# EAGLE design SWDIsolator (EAGLE 7.7.0)
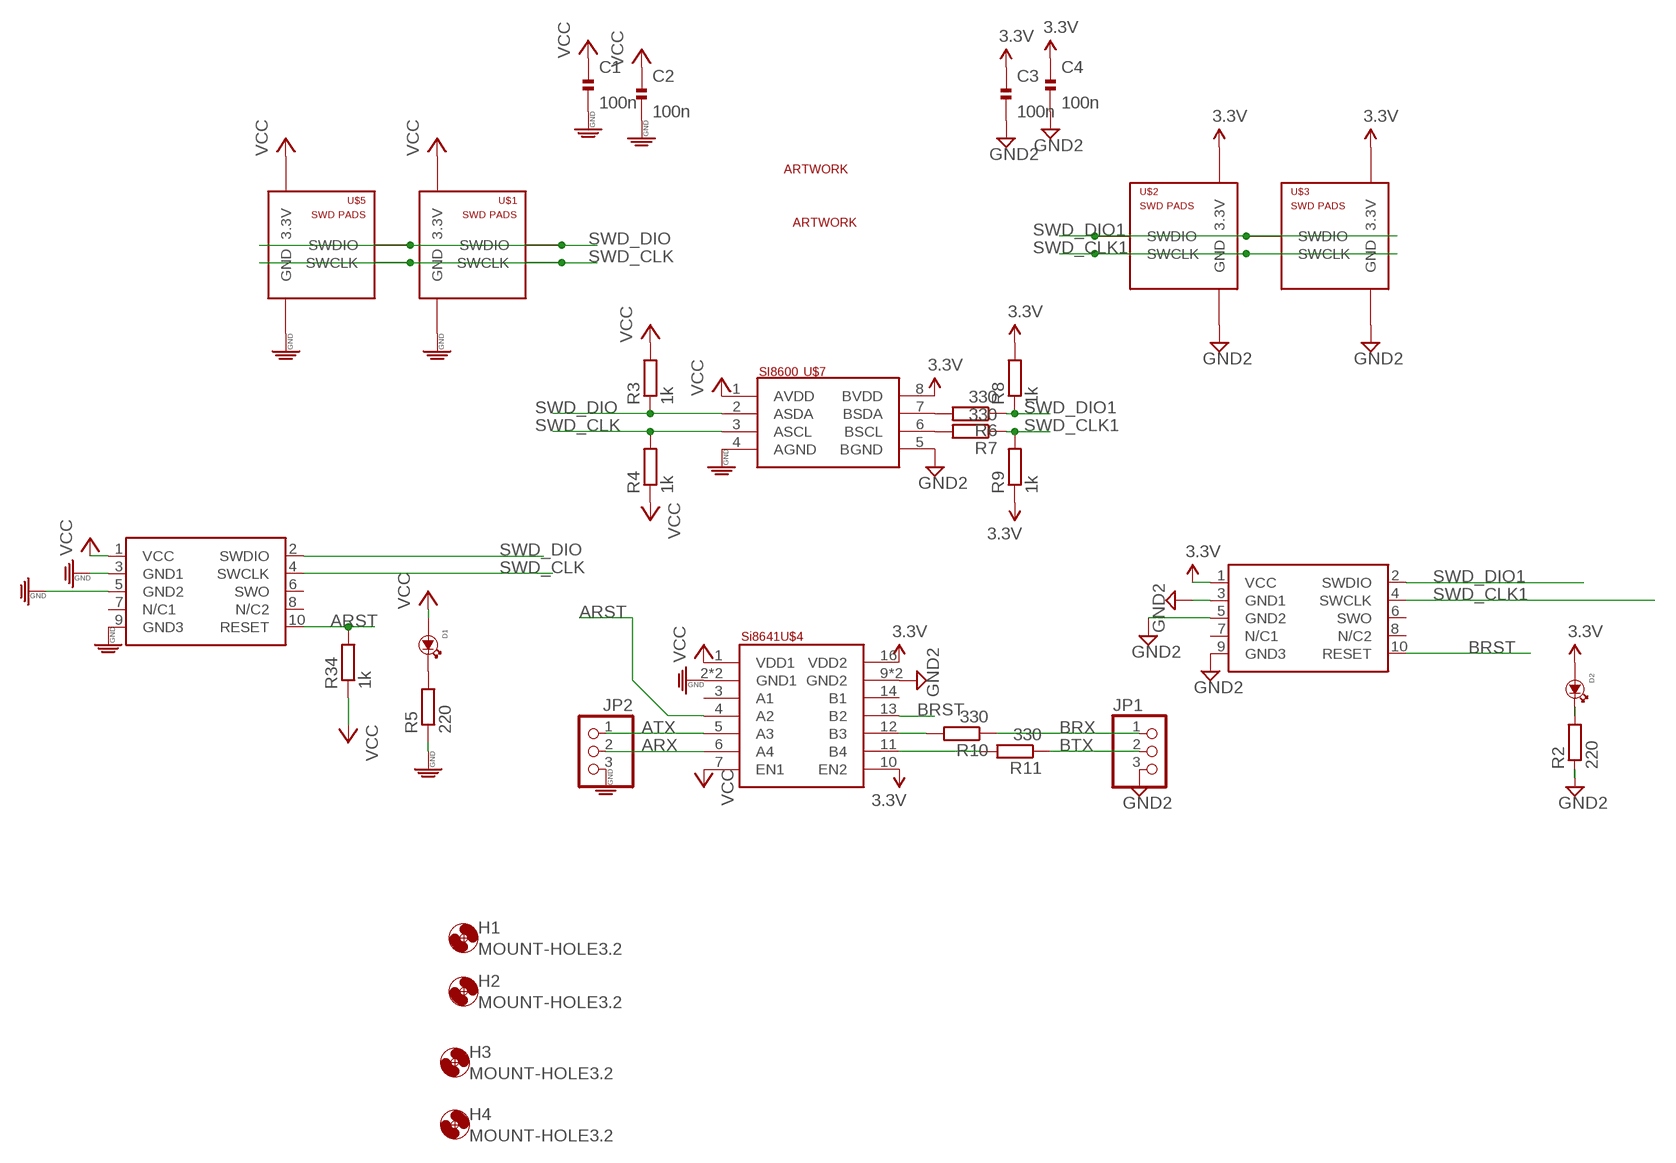
[diagram p0: schematic, sheet 1]

## Parts
C1  100n  C-EUC0402  [C0402]
C2  100n  C-EUC0402  [C0402]
C3  100n  C-EUC0402  [C0402]
C4  100n  C-EUC0402  [C0402]
D1  LED  [LED0603]
D2  LED  [LED0603]
H1  MOUNT-HOLE3.2  [3,2]
H2  MOUNT-HOLE3.2  [3,2]
H3  MOUNT-HOLE3.2  [3,2]
H4  MOUNT-HOLE3.2  [3,2]
JP1  PINHD-1X3CB  [1X03-CLEANBIG]
JP2  PINHD-1X3CB  [1X03-CLEANBIG]
R2  220  R-EU_R0402  [R0402]
R3  1k  R-EU_R0402  [R0402]
R4  1k  R-EU_R0402  [R0402]
R5  220  R-EU_R0402  [R0402]
R6  330  R-EU_R0402  [R0402]
R7  330  R-EU_R0402  [R0402]
R8  1k  R-EU_R0402  [R0402]
R9  1k  R-EU_R0402  [R0402]
R10  330  R-EU_R0402  [R0402]
R11  330  R-EU_R0402  [R0402]
R34  1k  R-EU_R0402  [R0402]
SWD1  CORTEX_SWD  [M50-3600542]
SWD2  CORTEX_SWD  [M50-3600542]
U$1  SWD_PADS  [SWDPADS]
U$2  SWD_PADS  [SWDPADS]
U$3  SWD_PADS_NOTITLE  [SWDPADS_NOTITLE]
U$4  SI8641  [SO16]
U$5  SWD_PADS_NOTITLE  [SWDPADS_NOTITLE]
U$6  TINRS_ARTWORKLOGO  [TINRSLOGO]
U$7  SI8600AB  SI8600  [SO8]
U$8  TINRS_ARTWORKROCKET  [TINRS_ROCKET]

## Nets
3.3V [power]: C3.1 C4.1 D2.+ R8.2 R9.1 SWD2.1(VCC) U$2.3.3V U$3.3.3V U$4.10(EN2) U$4.16(VDD2) U$7.8(BVDD)
ARST: R34.2 SWD1.10(RESET) U$4.4(A2)
ARX: JP2.2 U$4.6(A4)
ATX: JP2.1 U$4.5(A3)
BRST: SWD2.10(RESET) U$4.13(B2)
BRX: JP1.1 R10.1
BTX: JP1.2 R11.1
GND: C1.2 C2.2 JP2.3 R5.1 SWD1.3(GND1) SWD1.5(GND2) SWD1.9(GND3) U$1.GND U$4.2(GND1) U$4.8(GND1) U$5.GND U$7.4(AGND)
GND2: C3.2 C4.2 JP1.3 R2.1 SWD2.3(GND1) SWD2.5(GND2) SWD2.9(GND3) U$2.GND U$3.GND U$4.9(GND2) U$4.15(GND2) U$7.5(BGND)
N$1: R6.2 U$7.7(BSDA)
N$2: D1.- R5.2
N$3: D2.- R2.2
N$4: R7.2 U$7.6(BSCL)
N$5: R10.2 U$4.12(B3)
N$6: R11.2 U$4.11(B4)
SWD_CLK: R4.2 SWD1.4(SWCLK) U$1.SWCLK U$5.SWCLK U$7.3(ASCL)
SWD_CLK1: R7.1 R9.2 SWD2.4(SWCLK) U$2.SWCLK U$3.SWCLK
SWD_DIO: R3.1 SWD1.2(SWDIO) U$1.SWDIO U$5.SWDIO U$7.2(ASDA)
SWD_DIO1: R6.1 R8.1 SWD2.2(SWDIO) U$2.SWDIO U$3.SWDIO
VCC: C1.1 C2.1 D1.+ R3.2 R4.1 R34.1 SWD1.1(VCC) U$1.3.3V U$4.1(VDD1) U$4.7(EN1) U$5.3.3V U$7.1(AVDD)
Unconnected: SWD1.6(SWO) SWD1.7(N/C1) SWD1.8(N/C2) SWD2.6(SWO) SWD2.7(N/C1) SWD2.8(N/C2) U$4.3(A1) U$4.14(B1)

## Library data of the parts
C1-C4 = resistor:C-EU: CAPACITOR, European symbol
D1 D2 = EurorackModularParts:LED*: LED
H1-H4 = holes:MOUNT-HOLE: MOUNTING HOLE with drill center marker
JP1 JP2 = adafruit:PINHD-1X3: PIN HEADER
R2-R11 R34 = resistor:R-EU_: RESISTOR, European symbol; OC_FARNELL: unknown
SWD1 SWD2 = carrilib with jtags:CORTEX_SWD: .05" Cortex M Connector in SWD mode Manufacturer: Generic Part Number: Cortex M SWD Notes: I use Harwin M50-3600542 connectors; OC_FARNELL: unknown
U$1-U$3 U$5 = FenixBase:SWD_PADS
U$4 = FenixBase:SI8641
U$6 U$8 = EurorackModularParts:TINRS_ARTWORK
U$7 = FenixBase:SI8600

## Net classes
0 default: width 0.254 mm
1 power: width 0.305 mm

## Board
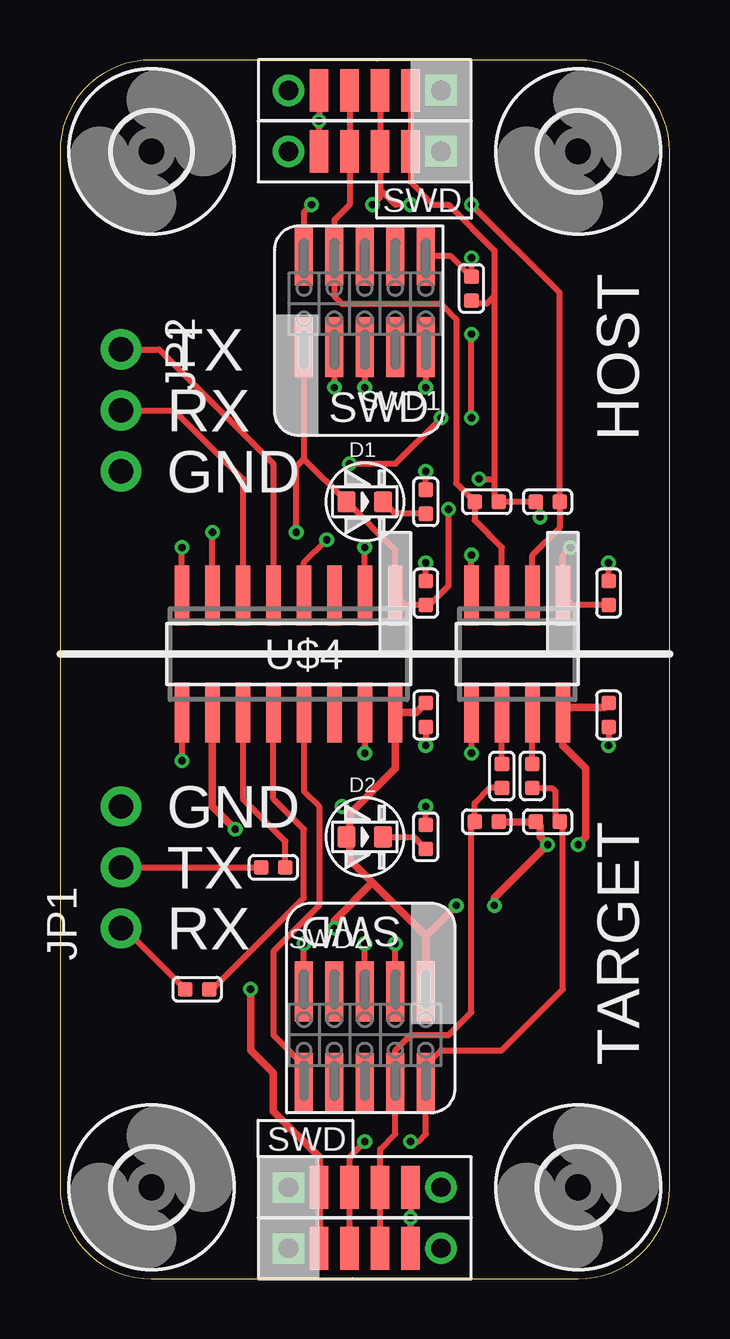
[diagram p1: board, top side]
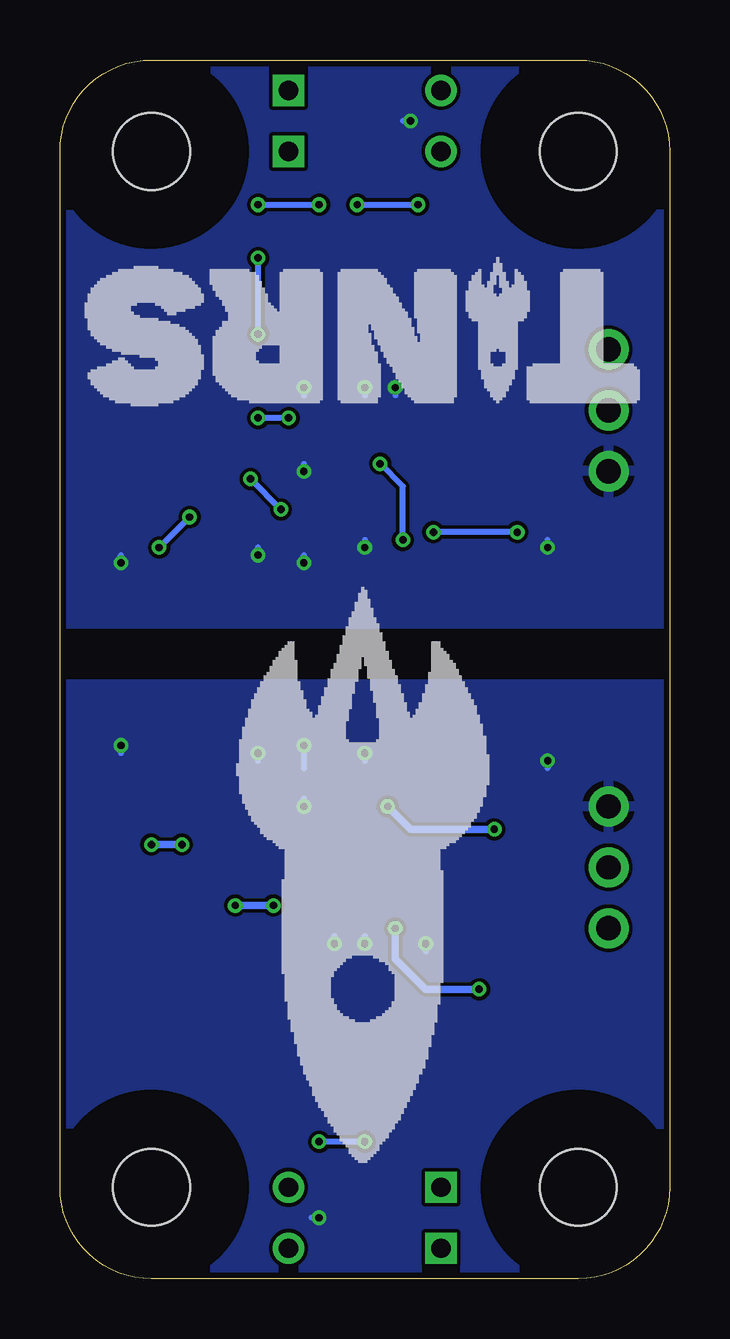
[diagram p2: board, bottom side, seen from below]

Size 25.4 x 50.8 mm. Coordinates in mm from the lower left corner, seen from the top.
Outline: 0,46.99 0,3.81 arc90 3.81,0 21.59,0 arc90 25.4,3.81 25.4,46.99 arc90 21.59,50.8 3.81,50.8 arc90 0,46.99
Copper layers (1*16): Top 0.035mm / dielectric 1.5mm / Bottom 0.035mm
Design rules "dirt_cheap_dirty_boards.v1.1": minimum track width 6mil, minimum drill 12mil, track to track 6mil, track to pad 6mil, pad to pad 6mil, via to via 6mil, smd to smd 0mil, copper to edge 10mil, drill to drill 10mil, minimum pad ring 10mil, minimum via ring 6mil, stop-mask expansion 2mil, vias tented up to drill 25mil, thermal gap 10mil

### Footprints (pad centres in the part's own frame; a part is rotated, then mirrored left to right if it is on the bottom)
C0402 = smd 0.6 x 0.6: 1 -0.5,0; 2 0.5,0
LED0603 = smd 0.762 x 0.889: + -0.762,0; - 0.762,0
3,2 = hole 3.2: 0,0
1X03-CLEANBIG = drill 1.016 pad 1.676: 1 -2.54,0; 2 0,0; 3 2.54,0
R0402 = smd 0.6 x 0.6: 1 -0.5,0; 2 0.5,0
M50-3600542 = smd 0.75 x 2.5: 1 -2.54,-1.81; 2 -2.54,2; 3 -1.27,-1.81; 4 -1.27,2; 5 0,-1.81; 6 0,2; 7 1.27,-1.81; 8 1.27,2; 9 2.54,-1.81; 10 2.54,2
SWDPADS = smd 0.762 x 1.778: 3.3V -1.905,0; GND 1.905,0; SWCLK 0.635,0; SWDIO -0.635,0 | drill 0.8 square: P$6 -3.175,0 | drill 0.8: P$7 3.175,0
SWDPADS_NOTITLE = smd 0.762 x 1.778: 3.3V -1.905,0; GND 1.905,0; SWCLK 0.635,0; SWDIO -0.635,0 | drill 0.8 square: P$6 -3.175,0 | drill 0.8: P$7 3.175,0
SO16 = smd 0.6 x 2.5: 1 -4.445,-2.435; 2 -3.175,-2.435; 3 -1.905,-2.435; 4 -0.635,-2.435; 5 0.635,-2.435; 6 1.905,-2.435; 7 3.175,-2.435; 8 4.445,-2.435; 9 4.445,2.435; 10 3.175,2.435; 11 1.905,2.435; 12 0.635,2.435; 13 -0.635,2.435; 14 -1.905,2.435; 15 -3.175,2.435; 16 -4.445,2.435
SO8 = smd 0.6 x 2.5: 1 -1.905,-2.435; 2 -0.635,-2.435; 3 0.635,-2.435; 4 1.905,-2.435; 5 1.905,2.435; 6 0.635,2.435; 7 -0.635,2.435; 8 -1.905,2.435

### Placement (x,y rotation side)
C1  15.24,28.57 90 top
C2  22.86,28.57 90 top
C3  22.86,23.5 270 top
C4  15.24,23.5 270 top
D1  12.7,32.38 0 top
D2  12.7,18.41 0 top
H1  3.81,3.81 0 top
H2  21.59,3.81 0 top
H3  3.81,46.99 0 top
H4  21.59,46.99 0 top
JP1  2.54,17.14 90 top
JP2  2.54,36.2 270 top
R2  15.24,18.41 270 top
R3  20.32,32.38 180 top
R4  17.78,32.38 180 top
R5  15.24,32.38 270 top
R6  19.68,20.95 90 top
R7  18.41,20.95 90 top
R8  20.32,19.05 180 top
R9  17.78,19.05 180 top
R10  5.71,12.06 0 top
R11  8.89,17.14 0 top
R34  17.14,41.27 90 top
SWD1  12.7,40.64 0 top
SWD2  12.7,10.16 180 top
U$1  12.7,46.99 180 top
U$2  12.7,3.81 0 top
U$3  12.7,1.27 0 top
U$4  9.53,26.04 180 top
U$5  12.7,49.53 180 top
U$6  12.7,39.37 180 bottom
U$7  19.05,26.04 180 top
U$8  12.7,12.06 270 bottom

### Tracks (layer width: path | path; a pad name or v marks a point on that pad's centre or on a via)
3.3V  (via drill 0.3)
  Top 0.305: U$3.3.3V U$2.3.3V 10.79,5.08 8.89,6.99 8.89,8.57 7.94,9.53 v7.94,12.06 | R9.1 R8.2 20,18.87 20,18.41 v20.32,18.1 18.1,15.88 v18.1,15.56 | SWD2.1 15.24,14.29 | 15.24,14.29 13.02,16.51 | 13.02,16.51 12.06,17.46 12.06,18.29 D2.+ 12.06,18.54 12.06,19.37 | 12.06,19.37 13.97,21.27 U$4.16 14.85,23.6 C4.1 | C3.1 22.68,23.81 20.95,23.81 U$7.8 20.95,22.23 21.91,21.27 21.91,18.41 v21.59,18.1 | 15.24,14.29 v16.51,15.56 | v11.43,14.61 11.43,14.92 13.02,16.51 | U$4.10 6.35,19.68 v7.3,18.73 | v11.75,19.68 12.06,19.37
  Bottom 0.305: v21.59,18.1 v20.32,18.1 | v16.51,15.56 v18.1,15.56 | v7.94,12.06 10.16,12.06 11.43,13.34 v11.43,14.61 | v7.3,18.73 10.79,18.73 v11.75,19.68
ARST  (via drill 0.3)
  Top 0.254: SWD1.10 16.28,42.64 R34.2 v17.14,42.55 | U$4.4 10.16,29.84 v11.11,30.8 | v12.06,33.97 13.97,33.97 v15.88,35.88 | v17.14,35.88 v17.14,39.37
  Bottom 0.254: v11.11,30.8 11.11,33.02 v12.06,33.97 | v15.88,35.88 v17.14,35.88 | v17.14,39.37 v17.14,42.55
ARX
  Top 0.254: JP2.2 4.76,36.2 7.62,33.34 U$4.6
ATX
  Top 0.254: JP2.1 4.13,38.73 8.89,33.97 U$4.5
BRST
  Top 0.254: U$4.13 10.16,20.32 10.79,19.68 10.79,15.56 8.89,13.65 8.89,10.16 10.16,8.89 SWD2.10
BRX
  Top 0.254: JP1.1 2.67,14.61 R10.1
BTX
  Top 0.254: JP1.2 R11.1
GND  (via drill 0.3)
  Top 0.254: U$5.GND v10.79,48.26 U$1.GND | SWD1.5 v12.7,37.15 | SWD1.3 v11.43,37.15 | SWD1.9 v15.24,37.15 | R5.1 v15.24,33.66 | C1.2 v15.24,29.84 | U$7.4 v17.14,30.16 | C2.2 v22.86,29.84 | U$4.8 v5.08,30.48 | U$4.2 v12.7,30.48
  Bottom 0.254: v10.79,48.26 11.11,48.26 | v12.7,37.15 12.7,36.83 | v11.43,37.15 11.43,36.83 | v15.24,37.15 15.24,36.83 | v15.24,33.66 15.24,33.97 | v15.24,29.84 15.24,30.16 | v17.14,30.16 17.14,30.48 | v22.86,29.84 22.86,30.16 | v5.08,30.48 5.08,30.8 | v12.7,30.48 12.7,30.8
  pour Bottom: -1.27,52.7 26.67,52.7 26.67,27.3 -1.27,27.3
GND2  (via drill 0.3)
  Top 0.254: U$4.9 v5.08,21.59 | SWD2.9 v10.16,13.97 | SWD2.5 v12.7,13.97 | SWD2.3 v13.97,13.97 | R2.1 v15.24,19.68 | C4.2 v15.24,22.23 | U$4.15 v12.7,21.91 | U$7.5 v17.14,21.91 | C3.2 v22.86,22.23 | U$3.GND v14.61,2.54 U$2.GND
  Bottom 0.254: v5.08,21.59 5.08,21.27 | v10.16,13.97 10.16,13.65 | v12.7,13.97 12.7,14.29 | v13.97,13.97 13.97,14.29 | v15.24,19.68 15.24,20 | v15.24,22.23 15.24,21.27 | v12.7,21.91 12.7,21.59 | v17.14,21.91 17.14,21.59 | v22.86,22.23 22.86,21.91 | v14.61,2.54 14.92,2.54
  pour Bottom: -1.27,24.77 26.67,24.77 26.67,-1.27 -1.27,-1.27
N$1
  Top 0.254: R6.2 U$7.7
N$2
  Top 0.254: R5.2 13.96,31.89 D1.-
N$3
  Top 0.254: D2.- 14.74,18.41 R2.2
N$4
  Top 0.254: R7.2 U$7.6
N$5
  Top 0.254: R10.2 6.35,12.06 10.16,15.88 10.16,18.73 8.89,20 U$4.12
N$6
  Top 0.254: U$4.11 7.62,20 9.39,18.23 R11.2
SWD_CLK
  Top 0.254: U$5.SWCLK U$1.SWCLK 12.06,44.77 11.43,44.13 SWD1.4 11.43,40.96 11.75,40.64 15.88,40.64 16.51,40.01 16.51,33.16 R4.2 17.28,31.61 18.41,30.48 U$7.3
SWD_CLK1
  Top 0.254: U$3.SWCLK U$2.SWCLK 13.34,5.4 13.97,6.03 SWD2.4 13.97,9.53 14.61,10.16 16.19,10.16 17.14,11.11 17.14,18.91 R9.2 17.28,19.82 17.91,20.45 R7.1
SWD_DIO  (via drill 0.3)
  Top 0.254: U$5.SWDIO U$1.SWDIO 13.34,45.4 | 13.34,45.4 13.34,45.09 v13.02,44.77 | v10.48,44.77 10.16,44.45 SWD1.2 | U$7.2 19.68,30.16 20.82,31.3 R3.1 20.82,41.09 v17.14,44.77 | v14.61,44.77 13.97,44.77 13.34,45.4
  Bottom 0.254: v13.02,44.77 v10.48,44.77 | v17.14,44.77 v14.61,44.77
SWD_DIO1  (via drill 0.3)
  Top 0.254: U$3.SWDIO U$2.SWDIO 12.06,5.08 v12.7,5.71 | v14.61,5.71 14.92,5.71 15.24,6.03 SWD2.2 15.24,8.89 15.88,9.53 18.41,9.53 20.95,12.06 20.95,18.91 R8.1 20.64,19.23 20.64,20.32 20.5,20.45 R6.1
  Bottom 0.254: v12.7,5.71 v14.61,5.71
VCC  (via drill 0.3)
  Top 0.254: U$5.3.3V U$1.3.3V 14.61,45.72 15.56,44.77 16.19,44.77 18.1,42.86 18.1,40.96 | 18.1,40.96 17.78,40.64 17.28,40.64 R34.1 | SWD1.1 10.16,34.16 | 10.16,34.16 D1.+ 13.97,30.35 U$4.1 14.37,28.07 C1.1 15.38,28.07 16.19,28.89 v16.19,32.07 | 18.1,40.96 18.1,33.34 | 18.1,33.34 18.1,32.57 R4.1 R3.2 20,32.2 v20,31.75 | C2.1 21.35,28.07 U$7.1 20.95,30.16 v21.27,30.48 | U$4.7 v6.35,31.11 | v9.84,31.11 9.84,33.85 10.16,34.16 | v17.46,33.34 18.1,33.34
  Bottom 0.254: v21.27,30.48 v20,31.75 | v6.35,31.11 v9.84,31.11 | v16.19,32.07 v17.46,33.34

### Text on the board
tPlace: TX | RX | HOST | GND | GND | TX | RX | TARGET